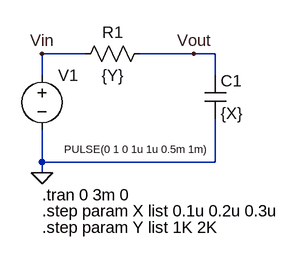
[diagram p0: schematic 03-Sweep Parameter.asc]
03-Sweep Parameter.asc, the LTspice schematic file:
Version 4
SHEET 1 880 680
WIRE 128 96 64 96
WIRE 288 96 208 96
WIRE 320 96 288 96
WIRE 64 128 64 96
WIRE 320 128 320 96
WIRE 64 256 64 208
WIRE 320 256 320 192
WIRE 320 256 64 256
WIRE 64 272 64 256
FLAG 64 96 Vin
FLAG 288 96 Vout
FLAG 64 272 0
SYMBOL voltage 64 112 R0
WINDOW 3 244 125 Right 1
WINDOW 123 0 0 Left 0
WINDOW 39 0 0 Left 0
SYMATTR Value PULSE(0 1 0 1u 1u 0.5m 1m)
SYMATTR InstName V1
SYMBOL res 224 80 R90
WINDOW 0 0 56 VBottom 2
WINDOW 3 32 56 VTop 2
SYMATTR InstName R1
SYMATTR Value {Y}
SYMBOL cap 304 128 R0
SYMATTR InstName C1
SYMATTR Value {X}
TEXT 64 304 Left 2 !.tran 0 3m 0
TEXT 64 328 Left 2 !.step param X list 0.1u 0.2u 0.3u
TEXT 64 352 Left 2 !.step param Y list 1K 2K

The netlist it stands for:
* 03-Sweep Parameter.asc
V1 Vin 0 PULSE(0 1 0 1u 1u 0.5m 1m)
R1 Vout Vin {Y}
C1 Vout 0 {X}
.tran 0 3m 0
.step param X list 0.1u 0.2u 0.3u
.step param Y list 1K 2K
.backanno
.end